# EAGLE design transmisorPCB_2.2 (EAGLE 7.6.0)
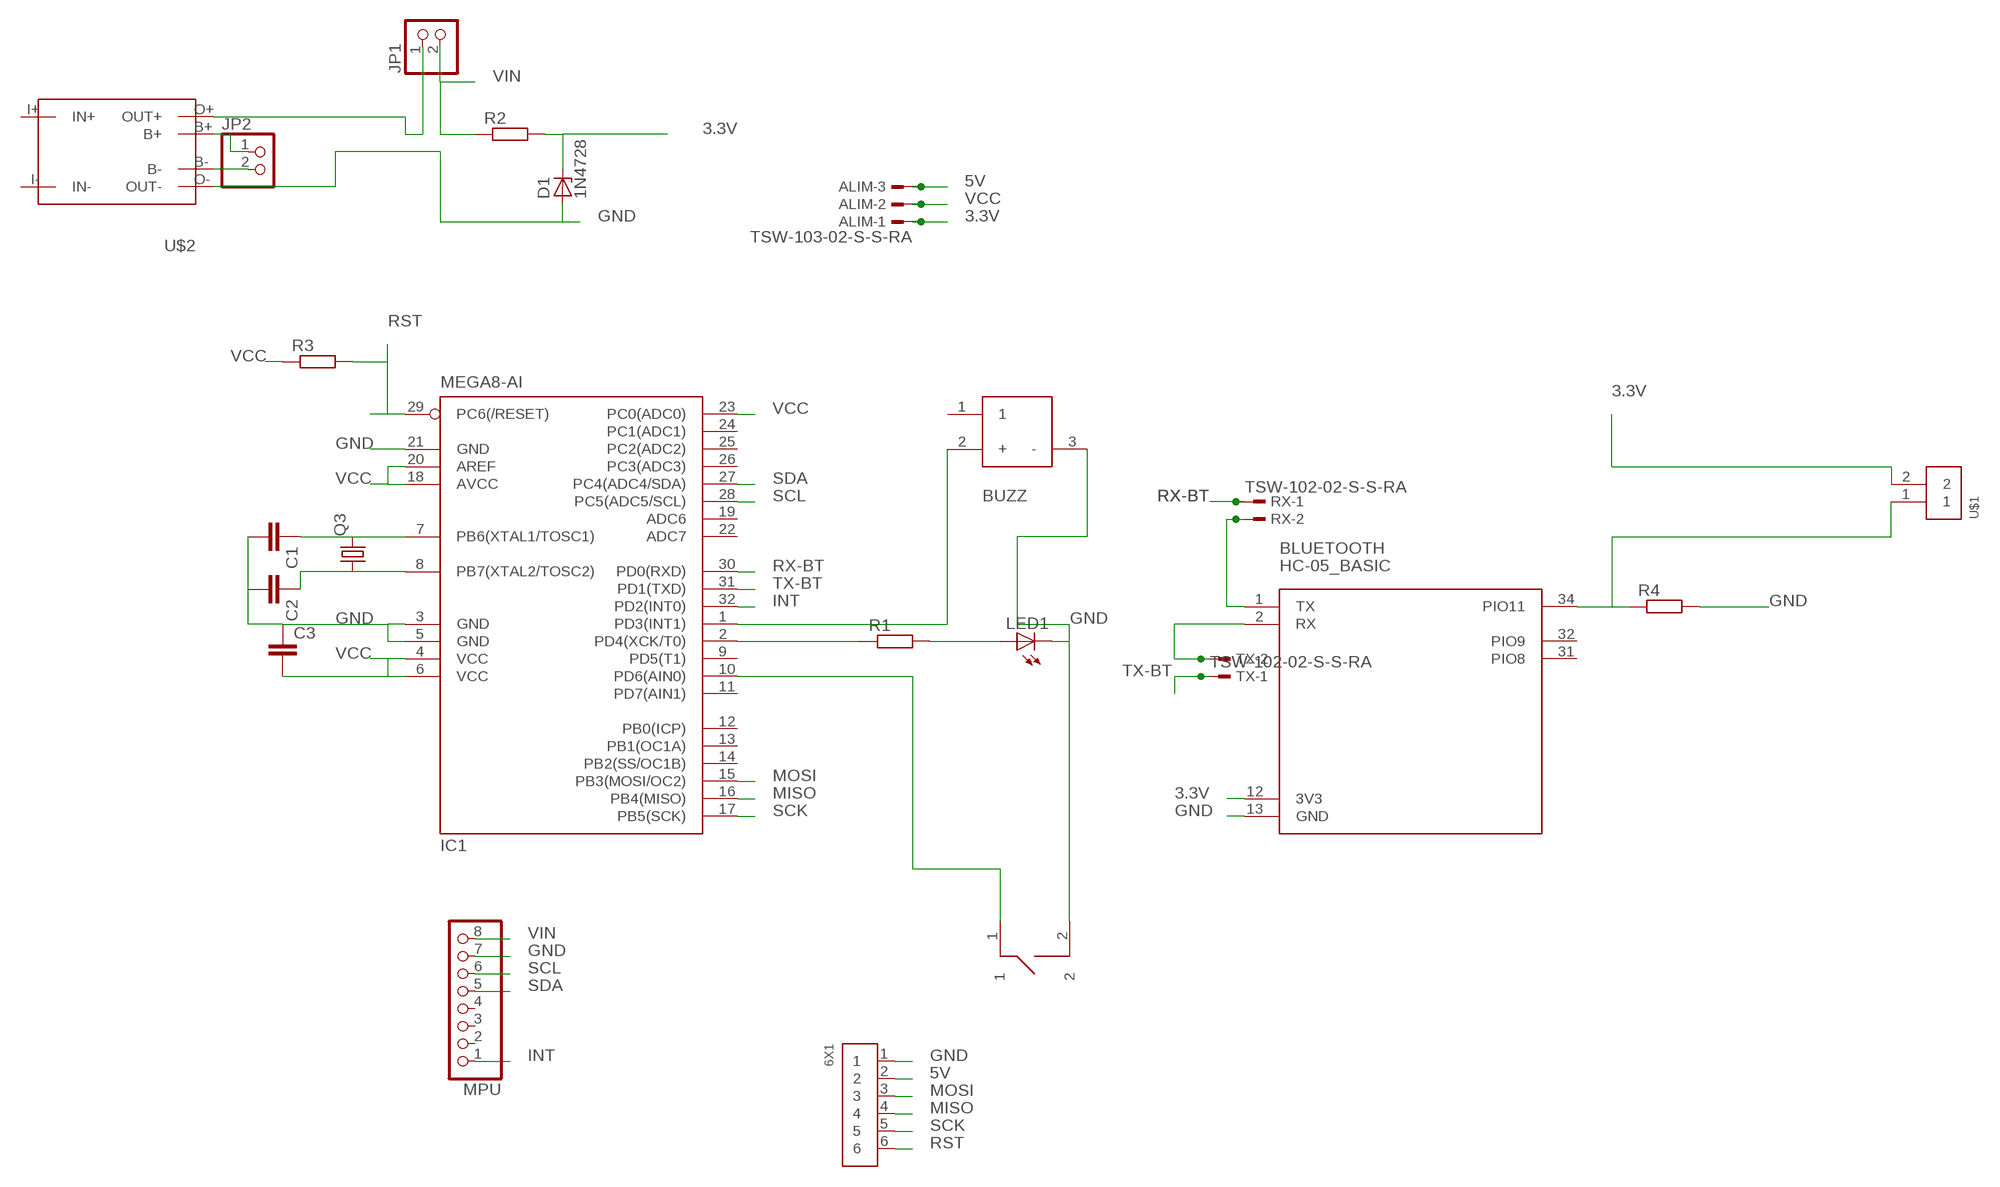
[diagram p0: schematic, sheet 1]

## Parts
6X1  PINHEAD_1X6  [PINHEAD_125_1X6]
ALIM  TSW-103-02-S-S-RA  [TSW-103-02-S-S-RA]
BLUETOOTH  HC-05_BASIC  [BLUETOOTH_SMD]
BUZZ  SM05ET02A  [SM05ET02A]
C1  C-EUC0402K  [C0402K]
C2  C-EUC0402K  [C0402K]
C3  C-EUC0402K  [C0402K]
D1  1N4728  [DO41Z10]
IC1  MEGA8-AI  [TQFP32-08]
JP1  PINHD-1X2  [1X02]
JP2  PINHD-1X2  [1X02]
LED1  LEDCHIPLED-0603-TTW  [CHIPLED-0603-TTW]
MPU  PINHD-1X8  [1X08]
PUSH  PUSH_SMD  [PUSH_SMD]
Q3  CRYSTALHC49U70  [HC49U70]
R1  R-EU_M1206  [M1206]
R2  R-EU_R2512  [R2512]
R3  R-EU_M1206  [M1206]
R4  R-EU_M1206  [M1206]
RX  TSW-102-02-S-S-RA  [TSW-102-02-S-S-RA]
TX  TSW-102-02-S-S-RA  [TSW-102-02-S-S-RA]
U$1  CP150_1X2  [CP150_1X2]
U$2  TP4056  [TP4056]

## Nets
3.3V: ALIM.1 BLUETOOTH.12(3V3) D1.C R2.2 U$1.2
5V: 6X1.2 ALIM.3
GND: 6X1.1 BLUETOOTH.13(GND) BUZZ.3(-) C1.2 C2.2 C3.1 D1.A IC1.3(GND) IC1.5(GND) IC1.21(GND) LED1.C@1(C) MPU.7 PUSH.2 R4.2 U$2.O-(OUT-)
INT: IC1.32(PD2(INT0)) MPU.1
MISO: 6X1.4 IC1.16(PB4(MISO))
MOSI: 6X1.3 IC1.15(PB3(MOSI/OC2))
N$1: JP1.1 U$2.O+(OUT+)
N$2: BLUETOOTH.2(RX) TX.2
N$3: C1.1 IC1.7(PB6(XTAL1/TOSC1)) Q3.2
N$4: C2.1 IC1.8(PB7(XTAL2/TOSC2)) Q3.1
N$5: BUZZ.2(+) IC1.1(PD3(INT1))
N$6: IC1.2(PD4(XCK/T0)) R1.1
N$7: JP2.2 U$2.B-
N$8: BLUETOOTH.1(TX) RX.2
N$9: JP2.1 U$2.B+
N$10: LED1.A@1(A) R1.2
N$12: BLUETOOTH.34(PIO11) R4.1 U$1.1
N$13: IC1.10(PD6(AIN0)) PUSH.1
RST: 6X1.6 IC1.29(PC6(/RESET)) R3.2
RX-BT: IC1.30(PD0(RXD)) RX.1
SCK: 6X1.5 IC1.17(PB5(SCK))
SCL: IC1.28(PC5(ADC5/SCL)) MPU.6
SDA: IC1.27(PC4(ADC4/SDA)) MPU.5
TX-BT: IC1.31(PD1(TXD)) TX.1
VCC: ALIM.2 C3.2 IC1.4(VCC) IC1.6(VCC) IC1.18(AVCC) IC1.20(AREF) IC1.23(PC0(ADC0)) R3.1
VIN: JP1.2 MPU.8 R2.1
Unconnected: BLUETOOTH.31(PIO8) BLUETOOTH.32(PIO9) BUZZ.1 IC1.9(PD5(T1)) IC1.11(PD7(AIN1)) IC1.12(PB0(ICP)) IC1.13(PB1(OC1A)) IC1.14(PB2(SS/OC1B)) IC1.19(ADC6) IC1.22(ADC7) IC1.24(PC1(ADC1)) IC1.25(PC2(ADC2)) IC1.26(PC3(ADC3)) MPU.2 MPU.3 MPU.4 U$2.I+(IN+) U$2.I-(IN-)

## Library data of the parts
6X1 = pinhead_125:PINHEAD_1X6
ALIM = con-samtec:TSW-103-02-S-S: THROUGH-HOLE .025" SQ POST HEADER Source: Samtec TSW.pdf; OC_FARNELL: unknown; OC_NEWARK: unknown
BLUETOOTH = hc05-own:HC-05_BASIC
BUZZ = buzzer2:SM05ET02A
C1-C3 = rcl:C-EU: CAPACITOR, European symbol
D1 = diode:1N4728: Z DIODE 3.3 V, 1W, 5 percent
IC1 = atmel:MEGA8: MICROCONTROLLER 8 Kbytes FLASH, 1 kbytes SRAM, 512 bytes EEPROM, USART, 6-channel 10 bit ADC, 2-channel 8 bit ADC Pin compatible with Atmega48, ATMega88, ATMega168 Source: avr.lbr; MPN: ATMEGA8-16AU; OC_FARNELL: 9171371; OC_NEWARK: 73M8863
JP1 JP2 = pinhead:PINHD-1X2: PIN HEADER
LED1 = led:LED: LED OSRAM: - CHIPLED LG R971, LG N971, LY N971, LG Q971, LY Q971, LO R971, LY R971 LH N974, LH R974 LS Q976, LO Q976, LY Q976 LO Q996 - Hyper CHIPLED LW Q18S LB Q993, LB Q99A, LB R99A - SideLED LS A670, LO A670, LY A670, LG A670, LP A670 LB A673, LV A673, LT A673, LW A673 LH A674 LY A675 LS A676, LA A676, LO A676, LY A676, LW A676 LS A679, LY A679, LG A679 - Hyper Micro SIDELED® LS Y876, LA Y876, LO Y876, LY Y876 LT Y87S - SmartLED LW L88C, LW L88S LB L89C, LB L89S, LG L890 LS L89K, LO L89K, LY L89K LS L896, LA L896, LO L896, LY L896 - TOPLED LS T670, LO T670, LY T670, LG T670, LP T670 LSG T670, LSP T670, LSY T670, LOP T670, LYG T670 LG T671, LOG T671, LSG T671 LB T673, LV T673, LT T673, LW T673 LH T674 LS T676, LA T676, LO T676, LY T676, LB T676, LH T676, LSB T676, LW T676 LB T67C, LV T67C, LT T67C, LS T67K, LO T67K, LY T67K, LW E67C LS E67B, LA E67B, LO E67B, LY E67B, LB E67C, LV E67C, LT E67C LW T67C LS T679, LY T679, LG T679 LS T770, LO T770, LY T770, LG T770, LP T770 LB T773, LV T773, LT T773, LW T773 LH T774 LS E675, LA E675, LY E675, LS T675 LS T776, LA T776, LO T776, LY T776, LB T776 LHGB T686 LT T68C, LB T68C - Hyper Mini TOPLED® LB M676 - Mini TOPLED Santana® LG M470 LS M47K, LO M47K, LY M47K Source: http://www.osram.convergy.de LUXEON: - LUMILED® LXK2-PW12-R00, LXK2-PW12-S00, LXK2-PW14-U00, LXK2-PW14-V00 LXK2-PM12-R00, LXK2-PM12-S00, LXK2-PM14-U00 LXK2-PE12-Q00, LXK2-PE12-R00, LXK2-PE12-S00, LXK2-PE14-T00, LXK2-PE14-U00 LXK2-PB12-K00, LXK2-PB12-L00, LXK2-PB12-M00, LXK2-PB14-N00, LXK2-PB14-P00, LXK2-PB14-Q00 LXK2-PR12-L00, LXK2-PR12-M00, LXK2-PR14-Q00, LXK2-PR14-R00 LXK2-PD12-Q00, LXK2-PD12-R00, LXK2-PD12-S00 LXK2-PH12-R00, LXK2-PH12-S00 LXK2-PL12-P00, LXK2-PL12-Q00, LXK2-PL12-R00 Source: www.luxeon.com KINGBRIGHT: KA-3528ASYC Source: www.kingbright.com
MPU = pinhead:PINHD-1X8: PIN HEADER
PUSH = push:PUSH_SMD
Q3 = crystal:CRYSTAL: CRYSTAL; OC_FARNELL: unknown; OC_NEWARK: unknown
R1 R3 R4 = rcl:R-EU_: RESISTOR, European symbol
R2 = resistor:R-EU_: RESISTOR, European symbol
RX TX = con-samtec:TSW-102-02-S-S: THROUGH-HOLE .025" SQ POST HEADER Source: Samtec TSW.pdf; OC_FARNELL: unknown; OC_NEWARK: unknown
U$1 = cp150:CP150_1X2
U$2 = tp4056:TP4056

## Board
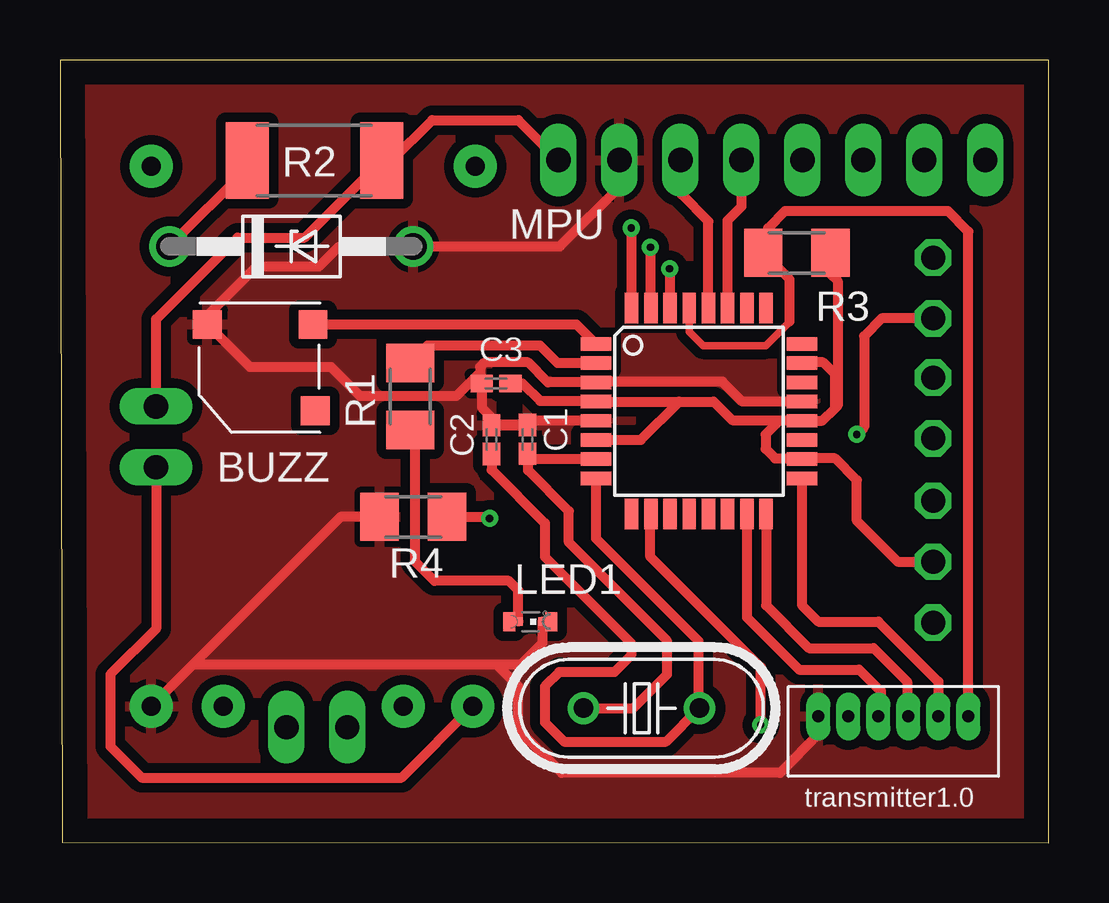
[diagram p1: board, top side]
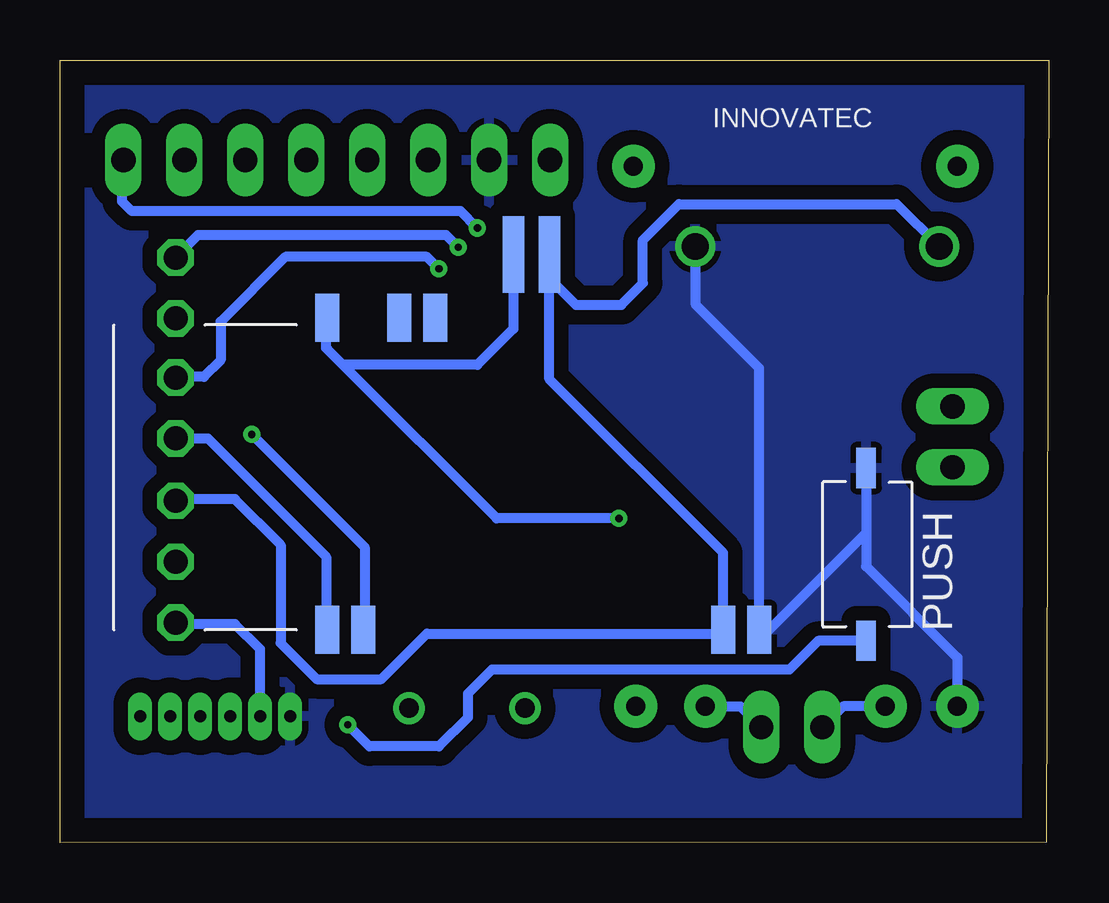
[diagram p2: board, bottom side, seen from below]

Size 41.19 x 32.61 mm. Coordinates in mm from the lower left corner, seen from the top.
Outline: 0.1,0.01 41.19,0 41.19,32.6 0,32.61 0.1,0.01
Copper layers (1*16): Top 0.035mm / dielectric 1.5mm / Bottom 0.035mm
Design rules "default": minimum track width 10mil, minimum drill 24mil, track to track 8mil, track to pad 8mil, pad to pad 8mil, via to via 8mil, smd to smd 8mil, copper to edge 40mil, drill to drill 8mil, minimum pad ring 10mil, minimum via ring 8mil, stop-mask expansion 4mil, vias tented up to drill 0mil, thermal gap 10mil

### Footprints (pad centres in the part's own frame; a part is rotated, then mirrored left to right if it is on the bottom)
PINHEAD_125_1X6 = drill 0.5 long: 1 -2.5,1.25; 2 -1.25,1.25; 3 0,1.25; 4 1.25,1.25; 5 2.5,1.25; 6 3.75,1.25
TSW-103-02-S-S-RA = drill 1 pad 1.5 octagon: 1 2.54,1.524; 2 0,1.524; 3 -2.54,1.524
BLUETOOTH_SMD = smd 2 x 1: 1 -6.35,3.81; 2 -6.35,2.31; 12 -6.35,-12.69; 13 -6.35,-14.19; 31 6.65,-0.69; 32 6.65,0.81; 34 6.65,3.81
SM05ET02A = smd 1.2 x 1.2: 1 -2.34,1.84; 2 -2.24,-1.76; 3 2.16,-1.76
C0402K = smd 0.925 x 0.74: 1 -0.6,0; 2 0.6,0
DO41Z10 = drill 1.118: A 5.08,0; C -5.08,0
TQFP32-08 = smd 1.27 x 0.559: 1 -4.293,2.8; 2 -4.293,2; 3 -4.293,1.2; 4 -4.293,0.4; 5 -4.293,-0.4; 6 -4.293,-1.2; 7 -4.293,-2; 8 -4.293,-2.8; 17 4.293,-2.8; 18 4.293,-2; 19 4.293,-1.2; 20 4.293,-0.4; 21 4.293,0.4; 22 4.293,1.2; 23 4.293,2; 24 4.293,2.8 | smd 0.559 x 1.27: 9 -2.8,-4.293; 10 -2,-4.293; 11 -1.2,-4.293; 12 -0.4,-4.293; 13 0.4,-4.293; 14 1.2,-4.293; 15 2,-4.293; 16 2.8,-4.293; 25 2.8,4.293; 26 2,4.293; 27 1.2,4.293; 28 0.4,4.293; 29 -0.4,4.293; 30 -1.2,4.293; 31 -2,4.293; 32 -2.8,4.293
1X02 = drill 1.016 long: 1 -1.27,0; 2 1.27,0
CHIPLED-0603-TTW = smd 0.8 x 0.5: A 0,-0.875; C 0,0.875 | smd 0.35 x 0.35: A@1 0,-0.5; C@1 0,0.5
1X08 = drill 1.016 long: 1 -8.89,0; 2 -6.35,0; 3 -3.81,0; 4 -1.27,0; 5 1.27,0; 6 3.81,0; 7 6.35,0; 8 8.89,0
PUSH_SMD = smd 1.676 x 0.813: 1 -3.4,-0.1; 2 3.8,-0.1
HC49U70 = drill 0.813: 1 -2.413,0; 2 2.413,0
M1206 = smd 1.6 x 2: 1 -1.4,0; 2 1.4,0
R2512 = smd 1.8 x 3.2: 1 -2.8,0; 2 2.8,0
TSW-102-02-S-S-RA = drill 1 pad 1.5 octagon: 1 1.27,1.524; 2 -1.27,1.524
CP150_1X2 = smd 0.9 x 3.2: 1 -0.7,4.4; 2 0.8,4.4
TP4056 = drill 0.8 pad 1.778: B+ -10.16,-4.15; B- -10.16,3.35; I+ 12.34,-7.15; I- 12.34,6.35; O+ -10.16,-7.05; O- -10.16,6.35

### Placement (x,y rotation side)
6X1  34.1,4.01 0 top
ALIM  37.9,11.71 90 top
BLUETOOTH  26.25,15.22 90 bottom
BUZZ  8.3,19.83 180 top
C1  19.48,16.8 90 top
C2  17.98,16.79 90 top
C3  18.17,19.13 0 top
D1  9.64,24.84 0 top
IC1  26.62,17.98 0 top
JP1  4,16.91 90 top
JP2  10.7,4.81 180 top
LED1  19.6,9.21 270 top
MPU  29.66,28.44 180 top
PUSH  7.7,11.81 90 bottom
Q3  24.23,5.6 180 top
R1  14.59,18.59 270 top
R2  10.6,28.42 180 top
R3  30.7,24.57 180 top
R4  14.72,13.57 180 top
RX  37.9,18.11 90 top
TX  37.9,23.11 90 top
U$1  21.6,20.11 0 bottom
U$2  10.15,15.84 90 top

### Tracks (layer width: path | path; a pad name or v marks a point on that pad's centre or on a via)
3.3V
  Top 0.406: R2.2 7.8,28.08 D1.C
  Bottom 0.406: D1.C 6.33,26.61 15.4,26.61 16.9,25.11 16.9,23.31 17.8,22.41 19.7,22.41 20.8,23.51 U$1.2 20.8,19.31 13.56,12.07 BLUETOOTH.12 13.72,8.71 25.9,8.71 27.8,6.81 30.5,6.81 32,8.31 32,12.41 33.9,14.31 36.32,14.31 ALIM.1
5V
  Bottom 0.406: 6X1.2 32.85,8.06 33.9,9.11 36.32,9.11 ALIM.3
GND
  Top 0.406: C2.2 C1.2 19.66,17.58 IC1.5 19.57,17.58 19.3,17.31 19.3,17.41 18.3,17.41 17.6,18.11 17.6,19.1 C3.1 17.5,19.2 17.5,19.61 | MPU.7 23.4,28.35 23.4,27.41 20.83,24.84 D1.A 14.69,24.81 11.6,24.81 10.8,24.01 8.2,24.01 6.14,21.95 BUZZ.3 7.92,19.81 11.3,19.81 12.5,18.61 16.5,18.61 17.5,19.61 | IC1.21 28.43,18.38 27.6,19.21 22.36,19.21 IC1.3 20.33,19.18 19.5,20.01 17.7,20.01 17.5,19.81 17.5,19.61 | R4.2 11.69,13.57 U$2.O- 5.53,7.41 18.2,7.41 | LED1.C@1 20.1,8.31 19.2,7.41 18.2,7.41 | 6X1.1 31.6,4.51 30,2.91 20.9,2.91 19.1,4.71 19.1,6.51 18.2,7.41
  Bottom 0.406: PUSH.2 7.6,12.91 | 7.6,12.91 7.6,11.51 3.8,7.71 U$2.O- | 7.6,12.91 11.64,8.87 BLUETOOTH.13 12.06,19.77 14.7,22.41 14.7,24.82 D1.A
  pour Bottom (isolate 0.61): 0.9,31.91 40.5,32.01 40.8,1.11 1.1,1.21
  pour Top (isolate 0.406): 0.9,32.01 40.7,31.91 40.6,0.41 0.9,0.51
INT  (via drill 0.3)
  Top 0.406: IC1.32 23.82,25.59 v23.8,25.61
  Bottom 0.406: v23.8,25.61 24.5,26.31 38.2,26.31 38.6,26.71 38.6,28.39 MPU.1
MISO
  Top 0.406: IC1.16 29.42,9.89 31.2,8.11 33.9,8.11 35.3,6.71 35.3,5.31 6X1.4
MOSI
  Top 0.406: IC1.15 28.62,9.39 30.8,7.21 33.3,7.21 34.2,6.31 34.2,5.36 6X1.3
N$1
  Top 0.406: JP1.1 4,8.91 2.1,7.01 2.1,4.01 3.4,2.71 14.23,2.71 U$2.O+
N$2  (via drill 0.3)
  Top 0.406: TX.2 34.23,21.84 33.5,21.11 33.5,17.31 v33.2,17.01
  Bottom 0.406: v33.2,17.01 28.5,12.31 28.5,8.93 BLUETOOTH.2
N$3
  Top 0.406: IC1.7 19.7,15.98 C1.1 19.5,16.18 19.5,15.51 21.2,13.81 21.2,12.51 25.3,8.41 25.3,7.01 23.89,5.6 Q3.2
N$4
  Top 0.406: IC1.8 22.33,12.68 26.6,8.41 26.6,5.64 Q3.1 25.25,4.21 21,4.21 20.2,5.01 20.2,6.51 20.8,7.11 23.1,7.11 23.8,7.81 23.8,8.31 20.2,11.91 20.2,13.31 17.98,15.53 C2.1
N$5
  Top 0.406: BUZZ.2 21.52,21.59 IC1.1
N$6
  Top 0.406: IC1.2 20.73,19.98 20,20.71 15.31,20.71 R1.1
N$7
  Bottom 0.406: U$2.B- 8.56,5.68 JP2.2
N$8
  Bottom 0.406: RX.2 35.03,16.84 30.1,11.91 30.1,8.91 BLUETOOTH.1
N$9
  Bottom 0.406: U$2.B+ 12.84,5.68 JP2.1
N$10
  Top 0.406: LED1.A@1 19.1,10.51 18.7,10.91 15.6,10.91 14.8,11.71 14.8,16.98 R1.2
N$12  (via drill 0.3)
  Top 0.406: R4.1 17.84,13.57 v17.9,13.51
  Bottom 0.406: U$1.1 22.3,21.41 23.8,19.91 29.4,19.91 | 29.4,19.91 30.05,20.56 30.1,20.61 30.1,21.83 BLUETOOTH.34 | v17.9,13.51 23,13.51 29.4,19.91
N$13  (via drill 0.3)
  Top 0.406: v29.2,4.91 29.2,7.31 24.6,11.91 24.6,13.67 IC1.10
  Bottom 0.406: PUSH.1 9.6,8.41 10.8,7.21 23.2,7.21 24.2,6.21 24.2,5.21 25.4,4.01 28.3,4.01 v29.2,4.91
RST
  Top 0.305: IC1.29 26.22,21.29 26.8,20.71 29.4,20.71 30.4,21.71
  Top 0.406: 30.4,21.71 30.4,23.47 R3.2 29.5,24.77 29.5,25.61 30.2,26.31 37,26.31 37.85,25.46 6X1.6
RX-BT  (via drill 0.3)
  Top 0.406: IC1.30 25.42,23.89 v25.4,23.91
  Bottom 0.406: v25.4,23.91 25.9,24.41 31.8,24.41 34.5,21.71 34.5,20.11 35.2,19.41 36.35,19.41 RX.1
SCK
  Top 0.406: IC1.17 30.91,9.9 31.6,9.21 34.1,9.21 36.6,6.71 6X1.5
SCL
  Top 0.406: IC1.28 27.02,25.89 25.9,27.01 25.9,28.29 MPU.6
SDA
  Top 0.406: IC1.27 27.82,25.93 28.4,26.51 28.4,28.33 MPU.5
TX-BT  (via drill 0.3)
  Top 0.406: IC1.31 24.62,24.79 v24.6,24.81
  Bottom 0.406: v24.6,24.81 25.1,25.31 35.45,25.31 TX.1
VCC
  Top 0.406: 25.8,18.38 IC1.4 22.3,18.41 20,18.41 19.28,19.13 C3.2 | 25.8,18.38 27.23,18.38 28,17.61 30.88,17.61 IC1.20 | IC1.6 24.2,16.78 25.8,18.38 | IC1.20 29.97,17.58 29.4,17.01 29.4,16.41 29.8,16.01 30.88,16.01 IC1.18 30.94,16.01 32.3,16.01 33.2,15.11 33.2,13.41 34.9,11.71 ALIM.2 | IC1.20 31.77,17.58 32.3,18.11 | 32.3,18.11 32.3,19.51 31.8,20.01 30.94,20.01 IC1.23 | 32.3,18.11 32.4,18.21 32.4,23.41 32.1,23.71 R3.1
VIN
  Top 0.406: MPU.8 19.1,30.11 15.5,30.11 13.81,28.42 R2.1 10.19,25.21 7.4,25.21 4,21.81 JP1.2

### Text on the board
tNames: transmitter1.0
bNames: INNOVATEC